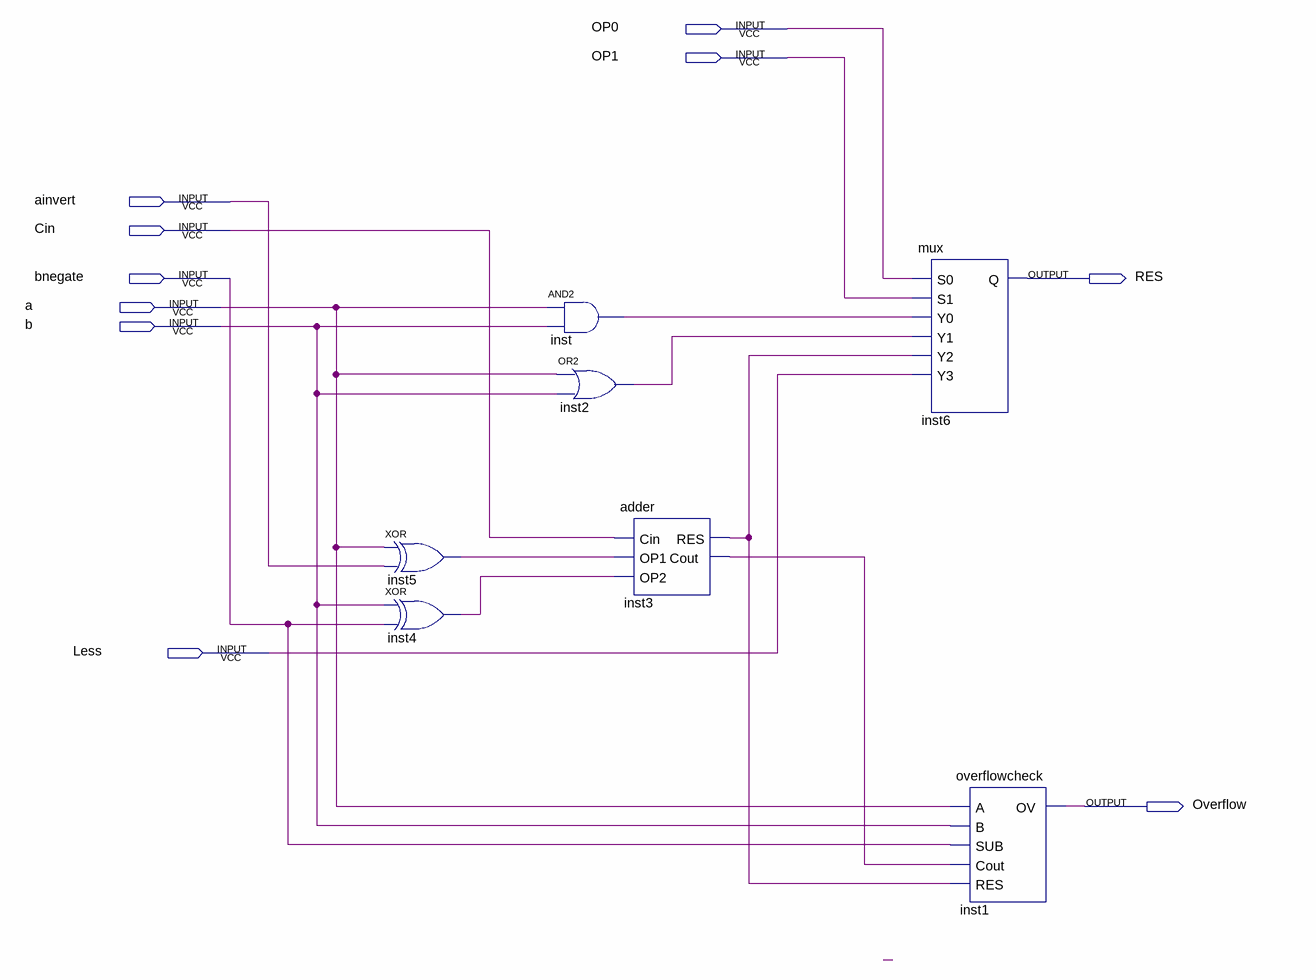
[diagram p0: schematic sheet]
// Quartus schematic lastUla.bdf as structural Verilog: 7 symbols, 10 pins
module lastUla (
  input  OP0,
  input  OP1,
  input  ainvert,
  input  Cin,
  input  bnegate,
  input  a,
  input  b,
  input  Less,
  output RES,
  output Overflow
);

  wire inst2_out, inst3_cout, inst3_res, inst4_out, inst5_out, inst_out;

  xor inst5 (inst5_out, a, ainvert);
  xor inst4 (inst4_out, b, bnegate);
  and inst (inst_out, a, b);
  or inst2 (inst2_out, a, b);
  adder inst3 (.Cin(Cin), .OP1(inst5_out), .OP2(inst4_out), .RES(inst3_res), .Cout(inst3_cout));
  mux inst6 (.S0(OP0), .S1(OP1), .Y0(inst_out), .Y1(inst2_out), .Y2(inst3_res), .Y3(Less), .Q(RES));
  overflowcheck inst1 (.A(a), .B(b), .SUB(bnegate), .Cout(inst3_cout), .RES(inst3_res), .OV(Overflow));
endmodule
